# EAGLE design 2m_bandpass (EAGLE 7.6.0)
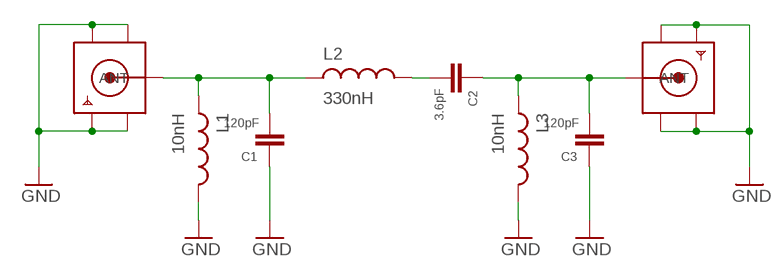
[diagram p0: schematic, sheet 1]

## Parts
C1  120pF  0805CAP  [0805]
C2  3.6pF  0805CAP  [0805]
C3  120pF  0805CAP  [0805]
L1  10nH  1008INDUCTOR  [1008INDUCTOR]
L2  330nH  1008INDUCTOR  [1008INDUCTOR]
L3  10nH  1008INDUCTOR  [1008INDUCTOR]
X1  SMACONNECTOR_EDGE  [SMA_EDGELAUNCH]
X2  SMACONNECTOR_EDGE  [SMA_EDGELAUNCH]

## Nets
GND: C1.P$2 C3.P$2 L1.P$2 L3.P$2 X1.GND@1(GND4) X1.GND@2(GND3) X1.GND@3(GND2) X1.GND@4(GND1) X2.GND@1(GND4) X2.GND@2(GND3) X2.GND@3(GND2) X2.GND@4(GND1)
N$1 [RF]: C1.P$1 L1.P$1 L2.P$1 X1.P(ANT)
N$3 [RF]: C2.P$2 C3.P$1 L3.P$1 X2.P(ANT)
N$5 [RF]: C2.P$1 L2.P$2

## Library data of the parts
C1-C3 = Samsung-Passives:0805CAP
L1-L3 = FerroCore:1008INDUCTOR
X1 X2 = adafruit:SMACONNECTOR: SMA Connector 90° DIP SMA Connector, 50 Ohm (4UConnector: 07259)

## Net classes
1 RF: width 1.016 mm, clearance 0.508 mm

## Board
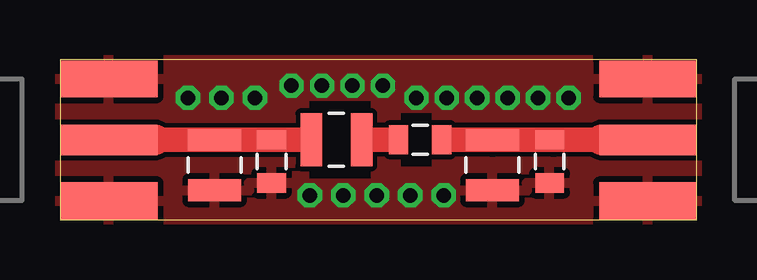
[diagram p1: board, top side]
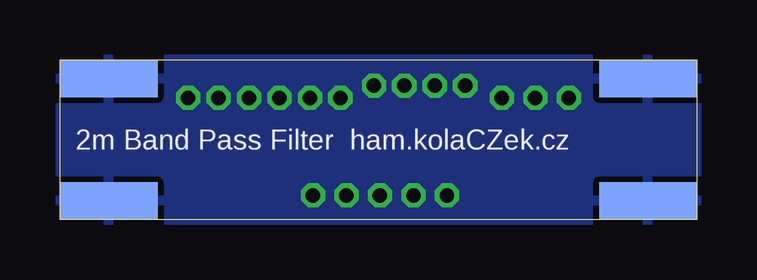
[diagram p2: board, bottom side, seen from below]

Size 26.55 x 6.66 mm. Coordinates in mm from the lower left corner, seen from the top.
Outline: 0,0 26.55,0 26.55,6.66 0,6.66 0,0
Copper layers (1*16): Top 0.035mm / dielectric 1.5mm / Bottom 0.035mm
Design rules "default *": minimum track width 10mil, minimum drill 24mil, track to track 8mil, track to pad 8mil, pad to pad 8mil, via to via 8mil, smd to smd 8mil, copper to edge 0mil, drill to drill 8mil, minimum pad ring 10mil, minimum via ring 8mil, stop-mask expansion 4mil, vias tented up to drill 100mil, thermal gap 10mil

### Footprints (pad centres in the part's own frame; a part is rotated, then mirrored left to right if it is on the bottom)
0805 = smd 0.8 x 1.2: P$1 -0.9,0; P$2 0.9,0
1008INDUCTOR = smd 0.9 x 2.2: P$1 -1.05,0; P$2 1.05,0
SMA_EDGELAUNCH = smd 4.064 x 1.524: GND@1 2.032,-2.54; GND@2 2.032,2.54 | smd 4.064 x 1.524 bottom: GND@3 2.032,2.54; GND@4 2.032,-2.54 | smd 4.064 x 1.27: P 2.032,0

### Placement (x,y rotation side)
C1  8.83,2.44 270 top
C2  15.02,3.33 0 top
C3  20.42,2.44 270 top
L1  6.45,2.28 270 top
L2  11.53,3.33 0 top
L3  18.03,2.28 270 top
X1  0,3.33 0 top
X2  26.55,3.33 180 top

### Tracks (layer width: path | path; a pad name or v marks a point on that pad's centre or on a via)
GND  (via drill 0.6)
  other vias: 5.33,5.08 6.73,5.08 8.13,5.08 9.65,5.59 12.19,5.59 14.86,5.08 13.46,5.59 10.41,1.02 11.81,1.02 13.21,1.02 14.61,1.02 16,1.02 10.92,5.59 21.21,5.08 19.94,5.08 18.67,5.08 17.4,5.08 16.13,5.08
  pour Top: 0,6.67 26.55,6.67 26.55,0 0,0
  pour Bottom: 0,6.67 26.55,6.67 26.55,0 0,0
N$1
  Top 0.254: 10.03,3.33 L2.P$1 | C1.P$1 9.14,3.34 9.14,3.33 | L1.P$1 6.6,3.33
  Top 1.016: 3.97,3.33 6.6,3.33 9.14,3.33 10.03,3.33
  Top 1.27: X1.P 3.97,3.33
N$2
  cutout Top: 10.41,4.95 12.95,4.95 12.95,1.73 10.41,1.73
N$3
  Top 0.254: 16.26,3.33 C2.P$2 | L3.P$1 | C3.P$1 20.57,3.34 20.57,3.33
  Top 1.016: 22.58,3.33 20.57,3.33 L3.P$1 16.26,3.33
  Top 1.27: X2.P 22.58,3.33
N$4
  cutout Top: 14.22,4.44 15.49,4.44 15.49,2.23 14.22,2.23
N$5
  Top 0.254: L2.P$2 12.9,3.33 | C2.P$1 13.84,3.33
  Top 1.016: 13.84,3.33 12.9,3.33

### Text on the board
bNames: 2m Band Pass Filter ham.kolaCZek.cz